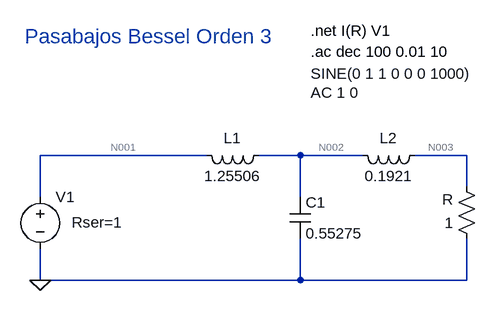
[diagram p0: schematic Circuito.asc]
Circuito.asc, the LTspice schematic file:
Version 4
SHEET 1 880 680
WIRE 240 96 -16 96
WIRE 384 96 320 96
WIRE 480 96 384 96
WIRE 640 96 560 96
WIRE 640 144 640 96
WIRE -16 160 -16 96
WIRE 384 160 384 96
WIRE -16 288 -16 240
WIRE 384 288 384 224
WIRE 384 288 -16 288
WIRE 640 288 640 224
WIRE 640 288 384 288
FLAG -16 288 0
SYMBOL res 656 240 R180
WINDOW 0 36 76 Left 2
WINDOW 3 36 40 Left 2
SYMATTR InstName R
SYMATTR Value 1
SYMBOL ind 336 80 R90
WINDOW 0 5 56 VBottom 2
WINDOW 3 32 56 VTop 2
SYMATTR InstName L1
SYMATTR Value 1.25506
SYMBOL ind 576 80 R90
WINDOW 0 5 56 VBottom 2
WINDOW 3 32 56 VTop 2
SYMATTR InstName L2
SYMATTR Value 0.1921
SYMBOL cap 368 160 R0
SYMATTR InstName C1
SYMATTR Value 0.55275
SYMBOL voltage -16 144 R0
WINDOW 123 416 -145 Left 2
WINDOW 39 48 55 Left 2
WINDOW 3 416 -174 Left 2
SYMATTR Value2 AC 1 0
SYMATTR SpiceLine Rser=1
SYMATTR Value SINE(0 1 1 0 0 0 1000)
SYMATTR InstName V1
TEXT 400 -64 Left 2 !.ac dec 100 0.01 10
TEXT 400 -96 Left 2 !.net I(R) V1
TEXT -40 -88 Left 3 ;Pasabajos Bessel Orden 3

The netlist it stands for:
* Circuito.asc
R 0 N003 1
L1 N002 N001 1.25506
L2 N003 N002 0.1921
C1 N002 0 0.55275
V1 N001 0 SINE(0 1 1 0 0 0 1000) AC 1 0 Rser=1
.ac dec 100 0.01 10
.net I(R) V1
* Pasabajos Bessel Orden 3
.backanno
.end

* Results of the author's LTspice run, read from the files saved beside the schematic
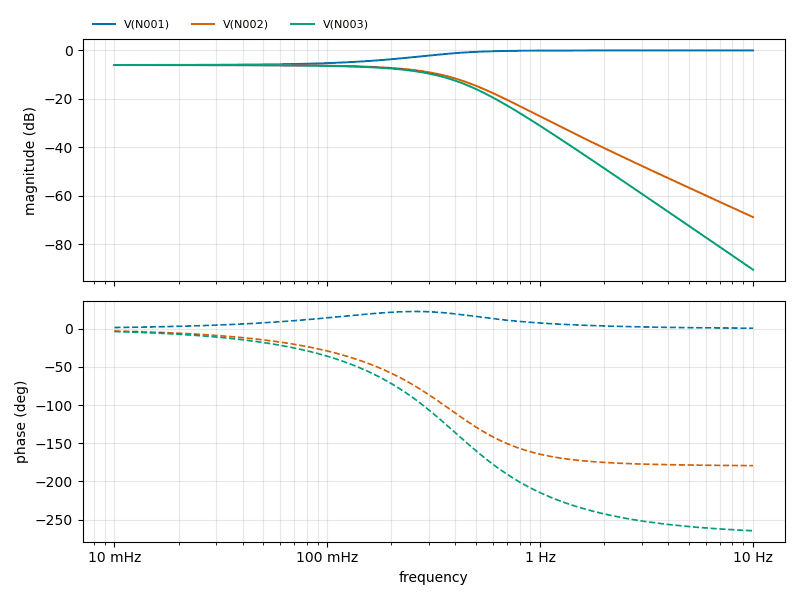
[diagram p1: AC Analysis of Circuito.asc, plotted from the saved traces]
* AC Analysis, 1 run:
*   V(N001): -6.00 dB at 10 mHz, -0.00 dB at 10 Hz, peak -0.00 dB at 10 Hz, 3 dB below the peak at 238.4 mHz
*   V(N002): -6.02 dB at 10 mHz, -68.73 dB at 10 Hz, peak -6.02 dB at 10 mHz, 3 dB below the peak at 301.5 mHz
*   V(N003): -6.03 dB at 10 mHz, -90.39 dB at 10 Hz, peak -6.03 dB at 10 mHz, 3 dB below the peak at 279.6 mHz